# EAGLE design eNode_Spark (EAGLE 6.4)

## Sheet 1 of 3: Power & MCU
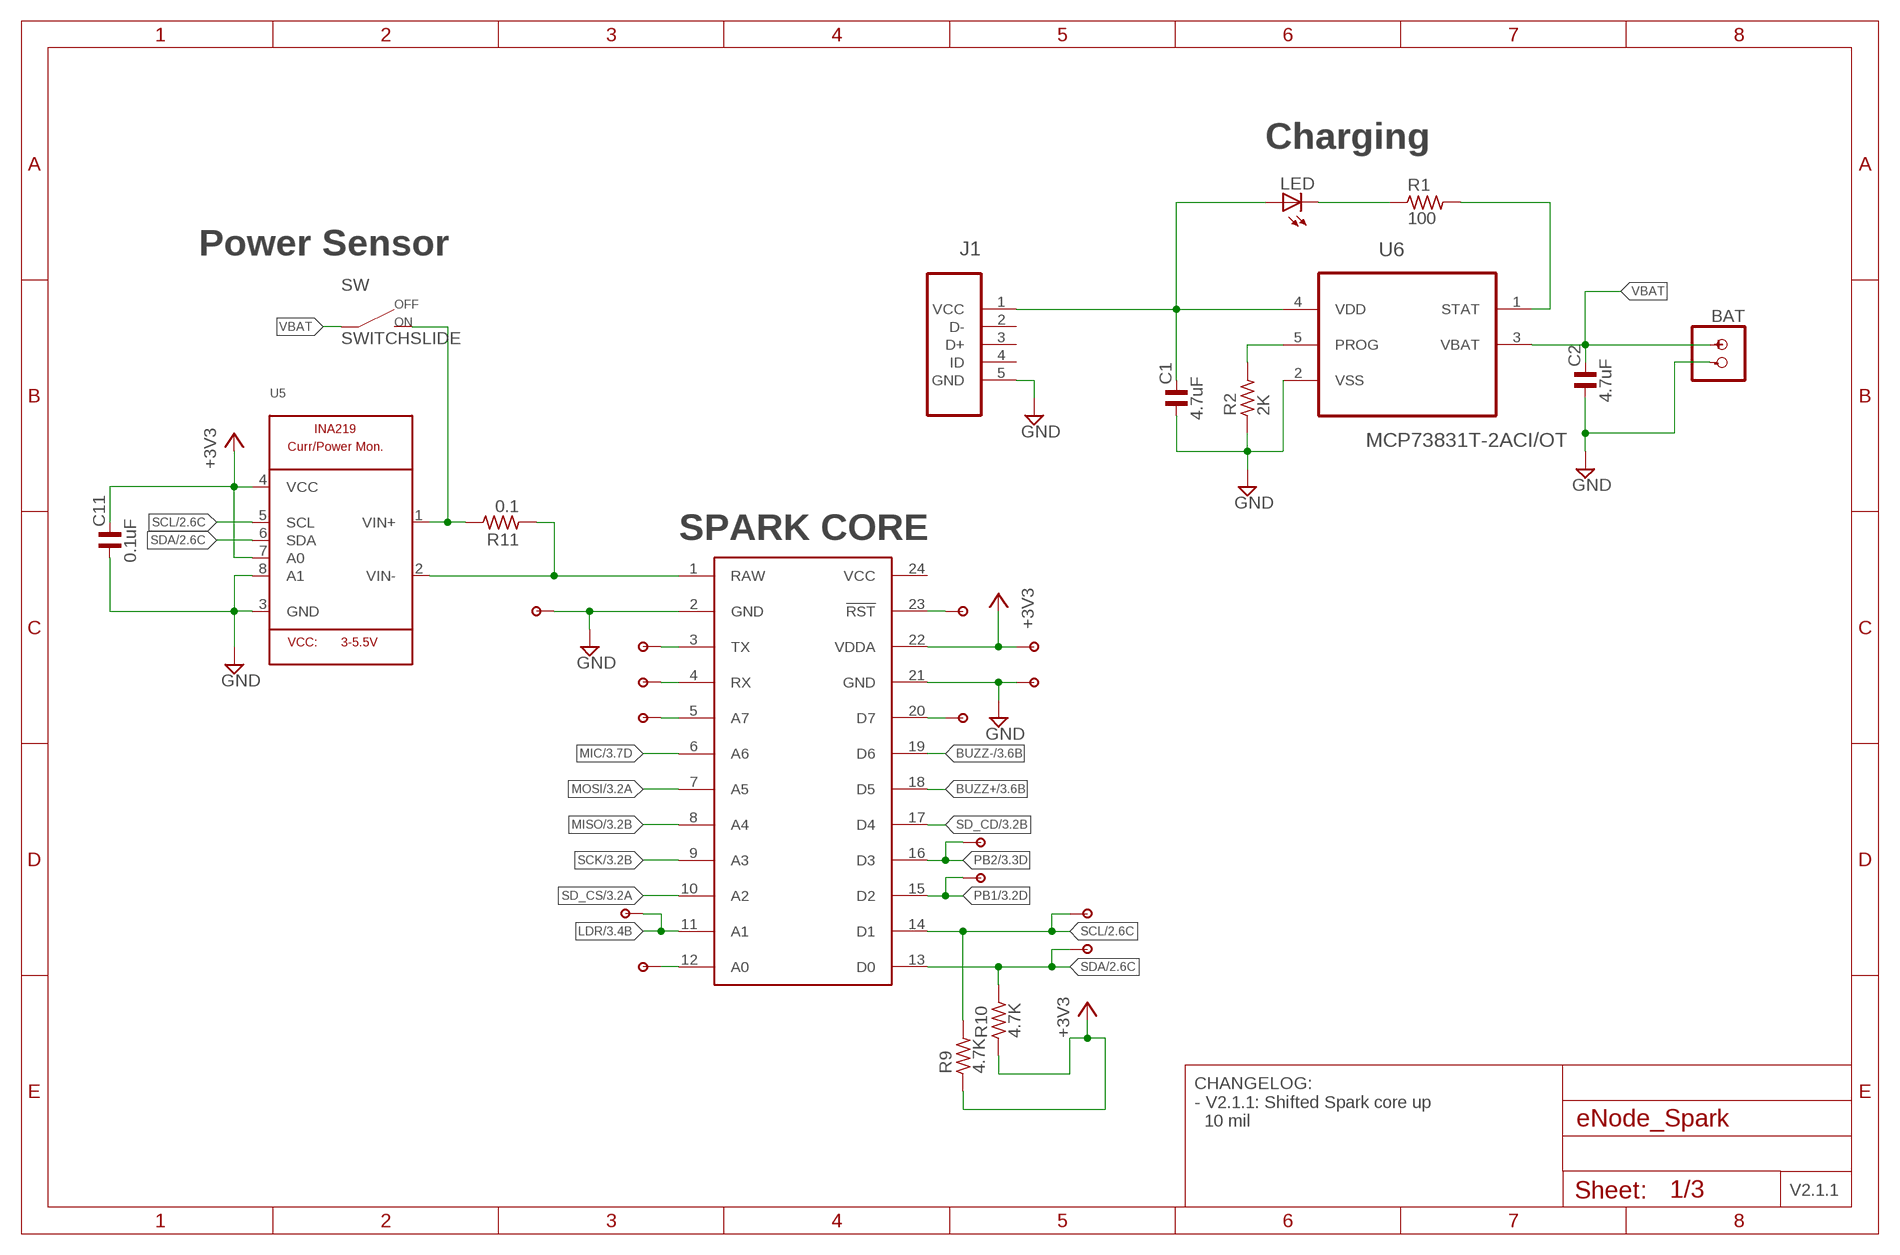
[diagram p0: schematic, sheet 1]

### Parts
BAT  BATTERYSMT  [JST-2-SMD]
C1  4.7uF  C_0402  [C0402]
C2  4.7uF  C_0402  [C0402]
C11  0.1uF  C_0402  [C0402]
J1  47346-0001  [MOLEX_47346-0001]
LED  LED  [RA_SMD_LED]
R1  100  R_0603  [R0603]
R2  2K  R_0603  [R0603]
R9  4.7K  R_0603  [R0603]
R10  4.7K  R_0603  [R0603]
R11  0.1  R_2512  [R2512]
SPARK  SPARK_CORECORE  [SPARK_CORE]
SW  SWITCHSLIDE  [CHANGE_OVER_SLIDE]
U5  INA219  [SOT23-8]
U6  MCP73831T-2ACI/OT  [SOT95P280X145-5N]
U$1  1PIN  [1PIN]
U$2  1PIN  [1PIN]
U$6  1PIN  [1PIN]
U$7  1PIN  [1PIN]
U$8  1PIN  [1PIN]
U$9  1PIN  [1PIN]
U$10  1PIN  [1PIN]
U$11  1PIN  [1PIN]
U$12  1PIN  [1PIN]
U$13  1PIN  [1PIN]
U$14  1PIN  [1PIN]
U$15  1PIN  [1PIN]
U$16  1PIN  [1PIN]
U$17  1PIN  [1PIN]

### Nets
+3V3: C11.2 R9.1 R10.1 SPARK.22(VDDA) U5.4(VCC) U5.7(A0) U$6.P$1 ; also sheet 2,3
BUZZ+: SPARK.18(D5) ; also sheet 3
BUZZ-: SPARK.19(D6) ; also sheet 3
GND: BAT.- C1.1 C2.1 C11.1 J1.5(GND) R2.1 SPARK.2(GND) SPARK.21(GND) U5.3(GND) U5.8(A1) U6.2(VSS) U$11.P$1 U$17.P$1 ; also sheet 2,3
LDR: SPARK.11(A1) U$16.P$1 ; also sheet 3
MIC: SPARK.6(A6) ; also sheet 3
MISO: SPARK.8(A4) ; also sheet 3
MOSI: SPARK.7(A5) ; also sheet 3
N$1: C1.2 J1.1(VCC) LED.A U6.4(VDD)
N$3: R11.1 SPARK.1(RAW) U5.2(VIN-)
N$4: R2.2 U6.5(PROG)
N$5: LED.C R1.1
N$6: R1.2 U6.1(STAT)
N$10: SPARK.5(A7) U$2.P$1
N$11: R11.2 SW.2 U5.1(VIN+)
N$15: SPARK.20(D7) U$10.P$1
N$16: SPARK.12(A0) U$1.P$1
N$19: SPARK.3(TX) U$12.P$1
N$20: SPARK.4(RX) U$13.P$1
N$21: SPARK.23(!RST) U$14.P$1
PB1: SPARK.15(D2) U$9.P$1 ; also sheet 3
PB2: SPARK.16(D3) U$15.P$1 ; also sheet 3
SCK: SPARK.9(A3) ; also sheet 3
SCL: R9.2 SPARK.14(D1) U5.5(SCL) U$7.P$1 ; also sheet 2
SD_CD: SPARK.17(D4) ; also sheet 3
SD_CS: SPARK.10(A2) ; also sheet 3
SDA: R10.2 SPARK.13(D0) U5.6(SDA) U$8.P$1 ; also sheet 2
VBAT: BAT.+ C2.2 SW.1 U6.3(VBAT)
Unconnected: J1.2(D-) J1.3(D+) J1.4(ID)

### Notes on the sheet
- Charging
- Power Sensor
- SPARK CORE
- CHANGELOG:
  - V2.1.1: Shifted Spark core up 
    10 mil
- V2.1.1

## Sheet 2 of 3: I2C
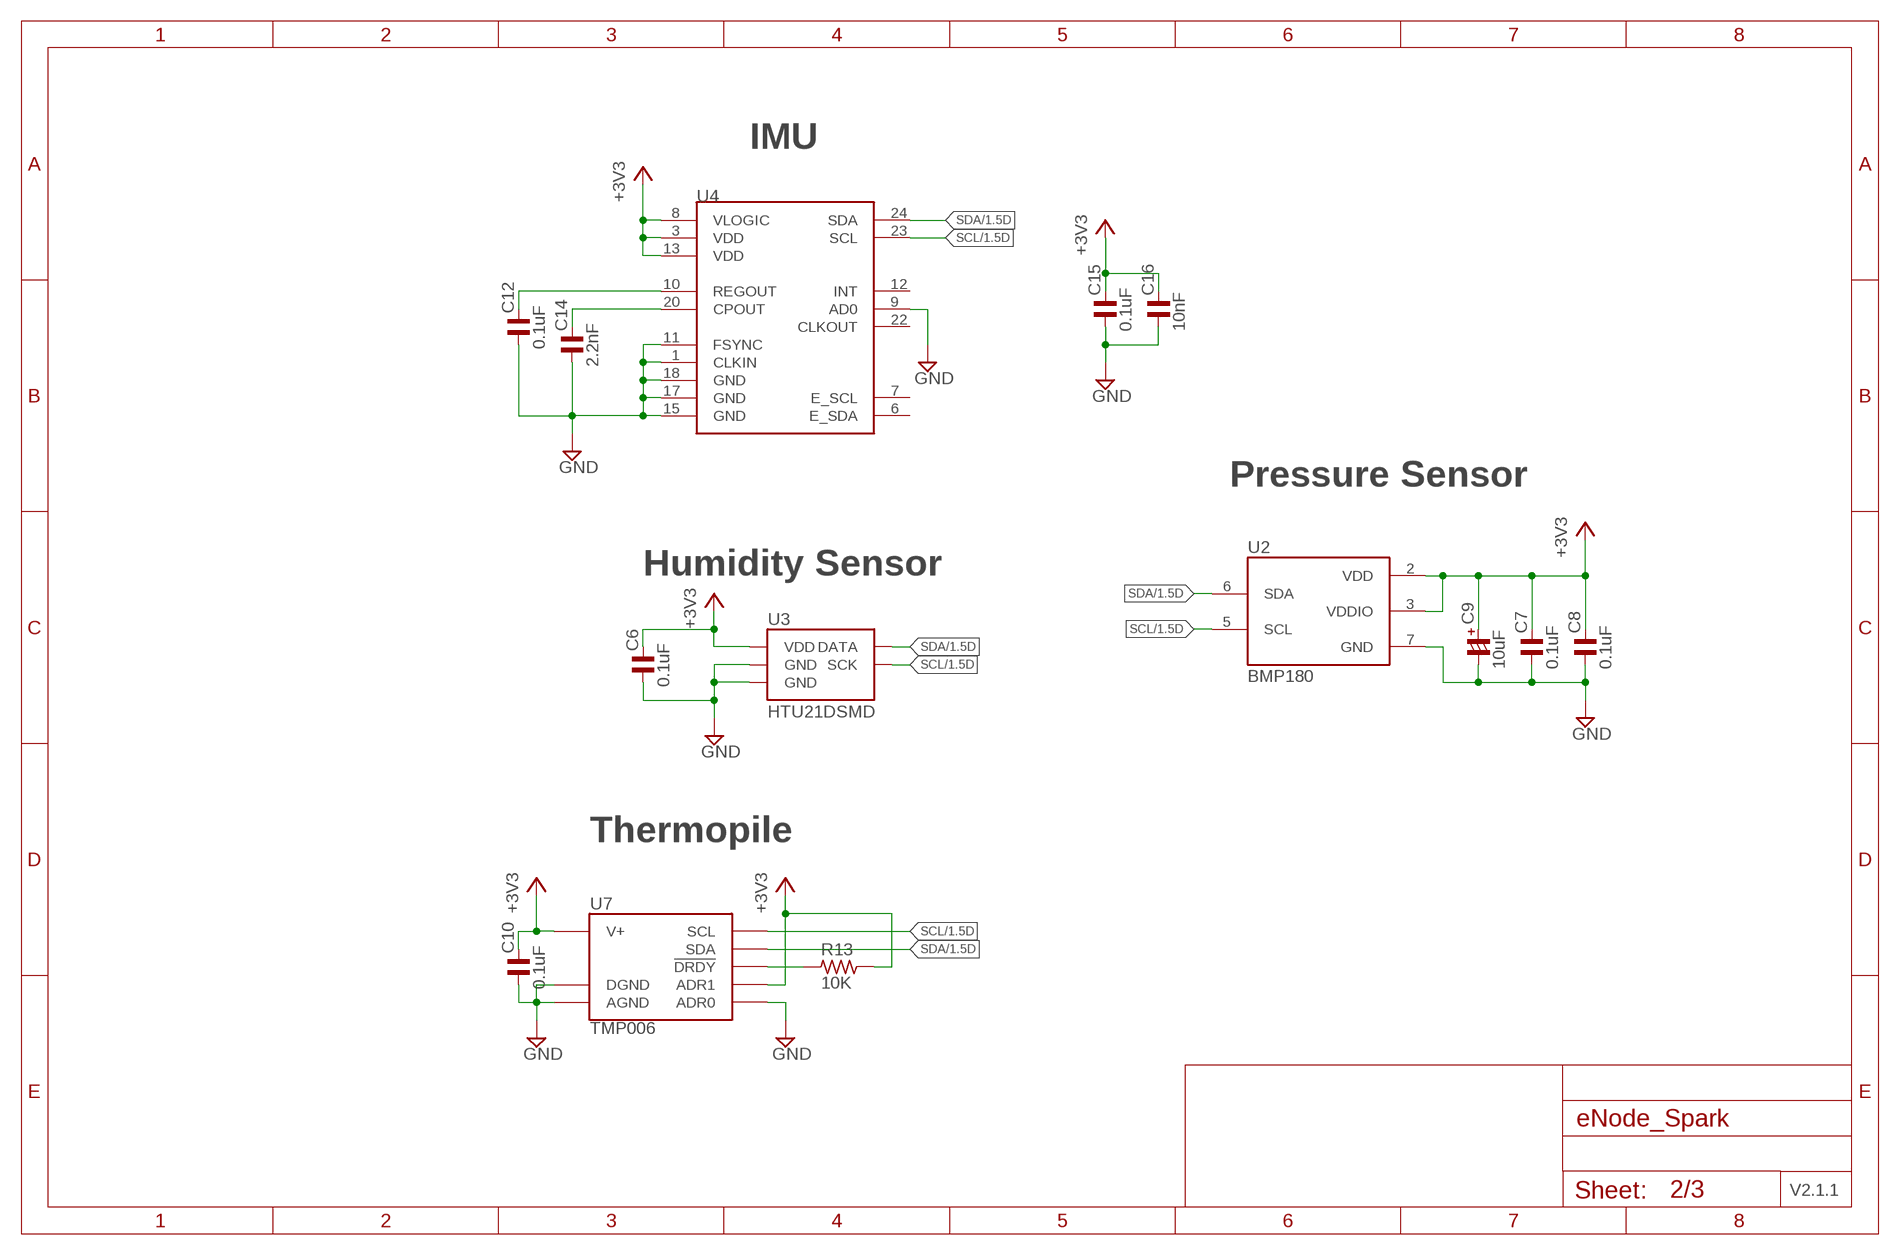
[diagram p1: schematic, sheet 2]

### Parts
C6  0.1uF  C_0402  [C0402]
C7  0.1uF  C_0402  [C0402]
C8  0.1uF  C_0402  [C0402]
C9  10uF  CP_1206/T  [C1206/T]
C10  0.1uF  C_0402  [C0402]
C12  0.1uF  C_0402  [C0402]
C14  2.2nF  C_0402  [C0402]
C15  0.1uF  C_0402  [C0402]
C16  10nF  C_0402  [C0402]
R13  10K  R_0603  [R0603]
U2  BMP180  [BMP180]
U3  HTU21DSMD  [HTU21D]
U4  MPU-9150QFN-24-NP  [QFN-24-NP]
U7  TMP006  [BGA8DS]

### Nets
+3V3: C6.2 C7.2 C8.2 C9.+ C10.2 C15.2 C16.2 R13.2 U2.2(VDD) U2.3(VDDIO) U3.VDD U4.3(VDD) U4.8(VLOGIC) U4.13(VDD) U7.A3(V+) U7.B1(ADR1) ; also sheet 1,3
GND: C6.1 C7.1 C8.1 C9.- C10.1 C12.1 C14.1 C15.1 C16.1 U2.7(GND) U3.7(GND) U3.GND U4.1(CLKIN) U4.9(AD0) U4.11(FSYNC) U4.15(GND) U4.17(GND) U4.18(GND) U7.A1(DGND) U7.A2(AGND) U7.C1(ADR0) ; also sheet 1,3
N$12: C14.2 U4.20(CPOUT)
N$13: R13.1 U7.C2(!DRDY)
N$14: C12.2 U4.10(REGOUT)
SCL: U2.5(SCL) U3.SCK U4.23(SCL) U7.B3(SCL) ; also sheet 1
SDA: U2.6(SDA) U3.DATA U4.24(SDA) U7.C3(SDA) ; also sheet 1
Unconnected: U4.6(E_SDA) U4.7(E_SCL) U4.12(INT) U4.22(CLKOUT)

### Notes on the sheet
- IMU
- Pressure Sensor
- Humidity Sensor
- Thermopile
- V2.1.1

## Sheet 3 of 3: Other IO
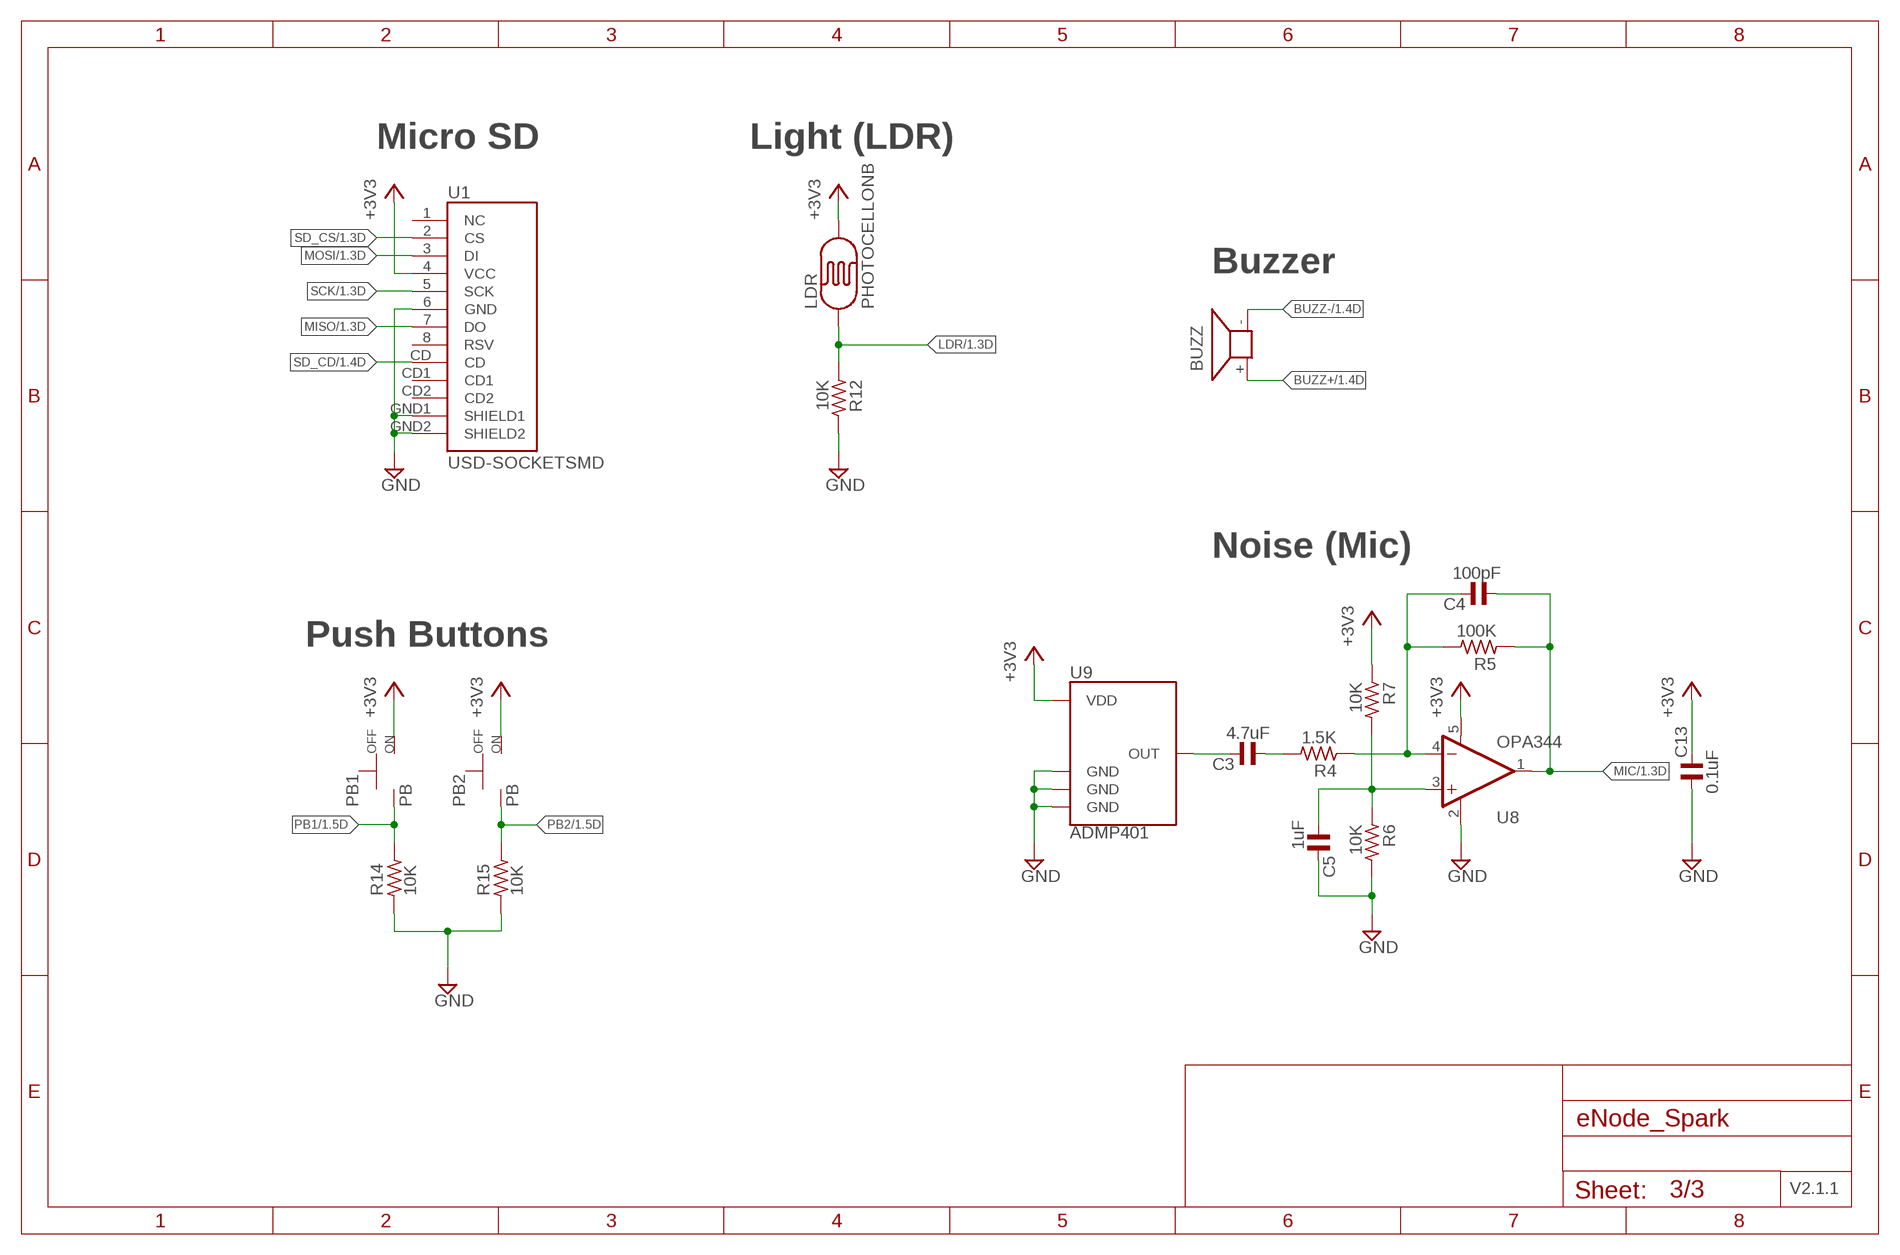
[diagram p2: schematic, sheet 3]

### Parts
BUZZ  BUZZER  [OFFBOARD_NOSIGN]
C3  4.7uF  C_0402  [C0402]
C4  100pF  C_0402  [C0402]
C5  1uF  C_0402  [C0402]
C13  0.1uF  C_0402  [C0402]
LDR  PHOTOCELLONB  [ON_BOARD]
PB1  PB  [PB]
PB2  PB  [PB]
R4  1.5K  R_0402  [R0402]
R5  100K  R_0402  [R0402]
R6  10K  R_0402  [R0402]
R7  10K  R_0402  [R0402]
R12  10K  R_0603  [R0603]
R14  10K  R_0603  [R0603]
R15  10K  R_0603  [R0603]
U1  USD-SOCKETSMD  [MICRO-SD-SOCKET-PP]
U8  OPA344  [SOT23-5]
U9  ADMP401  [ADMP401]

### Nets
+3V3: C13.2 LDR.2 PB1.2 PB2.2 R7.1 U1.4(VCC) U8.5(V+) U9.5(VDD) ; also sheet 1,2
BUZZ+: BUZZ.+ ; also sheet 1
BUZZ-: BUZZ.- ; also sheet 1
GND: C5.2 C13.1 R6.2 R12.2 R14.1 R15.1 U1.6(GND) U1.GND1(SHIELD1) U1.GND2(SHIELD2) U8.2(V-) U9.2(GND) U9.4(GND) U9.6(GND) ; also sheet 1,2
LDR: LDR.1 R12.1 ; also sheet 1
MIC: C4.1 R5.1 U8.1(OUT) ; also sheet 1
MISO: U1.7(DO) ; also sheet 1
MOSI: U1.3(DI) ; also sheet 1
N$2: C3.2 U9.1(OUT)
N$7: C3.1 R4.2
N$8: C4.2 R4.1 R5.2 U8.4(-IN)
N$9: C5.1 R6.1 R7.2 U8.3(+IN)
PB1: PB1.1 R14.2 ; also sheet 1
PB2: PB2.1 R15.2 ; also sheet 1
SCK: U1.5(SCK) ; also sheet 1
SD_CD: U1.CD ; also sheet 1
SD_CS: U1.2(CS) ; also sheet 1
Unconnected: U1.1(NC) U1.8(RSV) U1.CD1 U1.CD2

### Notes on the sheet
- Micro SD | Light (LDR)
- Buzzer
- Noise (Mic)
- Push Buttons
- V2.1.1

## Power pins joined to a net without a drawn wire
VCC: SPARK.24(VCC)

## Library data of the parts
BAT = Battery:BATTERY: PIN HEADER
BUZZ = Buzzer:BUZZER: Buzzer
C1-C8 C10-C16 = rc-master-smd:C_: NON-POLARIZED CAP
C9 = rc-master-smd:CP_: POLARIZED CAP
J1 = Micro USB B:47346-0001: CONN RCPT 5POS MICRO USB R/A SMD; MPN: 47346-0001; OC_FARNELL: 1568026; OC_NEWARK: 47M0505; PACKAGE: 5 POS MICRO USB R/A; SUPPLIER: MOLEX
LDR = LDR:PHOTOCELL: Photo Resitor
LED = LED:LED: LEDs
PB1 PB2 = Push Button:PB
R1 R2 R4-R7 R9-R15 = rc-master-smd:R_: RESISTOR
SPARK = Spark Core:SPARK_CORE
SW = Switch:SWITCH
U1 = MicroSD:USD-SOCKET: microSD Socket Push-push type uSD socket. Schematic element and footprint production proven. Spark Fun Electronics SKU : PRT-00127. tDoc lines correctly indicate media card edge positions when inserting (unlocked, locked, depressed).; ORDERCODE: 2143377; SUPPLIER: ELEMENT14
U2 = BMP180:BMP180: BOSCH BMP180 DIGITAL BAROMETRIC PRESSURE SENSOR Web page: http://www.bosch-sensortec.com/en/homepage/products_3/environmental_sensors_1/bmp180_1/bmp180 Datasheet: http://ae-bst.resource.bosch.com/media/products/dokumente/bmp180/BST-BMP180-DS000-09.pdf The BMP180 is the function compatible successor of the BMP085, a new generation of high precision digital pressure sensors for consumer applications. The ultra-low power, low voltage electronics of the BMP180 is optimized for use in mobile phones, PDAs, GPS navigation devices and outdoor equipment. With a low altitude noise of merely 0.25m at fast conversion time, the BMP180 offers superior performance. The I2C interface allows for easy system integration with a microcontroller. The BMP180 is based on piezo-resistive technology for EMC robustness, high accuracy and linearity as well as long term stability. Key features: - Temperature measurement included - I2C interface - Fully calibrated - Pb-free, halogen-free and RoHS compliant, - MSL 1 Basic specs: Pressure range: 300 to 1100hPa (+9000m to -500m relating to sea level) Supply voltage: 1.8 to 3.6V (VDD), 1.62V to 3.6V (VDDIO) Package: LGA package with metal lid Small footprint: 3.6mm x 3.8mm Super-flat: 0.93mm height Low power: 5µA at 1 sample / sec. in standard mode Low noise: 0.06hPa (0.5m) in ultra low power mode, 0.02hPa (0.17m) advanced resolution mode Typical applications: - Enhancement of GPS navigation (dead-reckoning, slope detection, etc.) - In- and out-door navigation - Leisure and sports - Weather forecast - Vertical velocity indication (rise/sink speed)
U3 = HTU21D:HTU21D
U4 = MPU-9150:MPU-9150: 9DOF (3mag, 3accel, 3rotat). I2C interface.
U5 = INA219:INA219: INA219 - I2C Current/Power Monitor Voltage Range: 0-26V Accuracy: 0.5% Temperature: -40°C - 125°C
U6 = MCP73831T (LiPo Charger):MCP73831T-2ACI/OT: Charge Management Controller; MPN: MCP73831T-2ACI/OT; OC_FARNELL: 1332158; OC_NEWARK: 56K7045; PACKAGE: SOT-5; SUPPLIER: Microchip
U7 = TMP006:TMP006
U8 = OPA344:OPA344
U9 = ADMP401:ADMP401
U$1 U$2 U$6-U$17 = Single Pin Breakout:1PIN

## Board
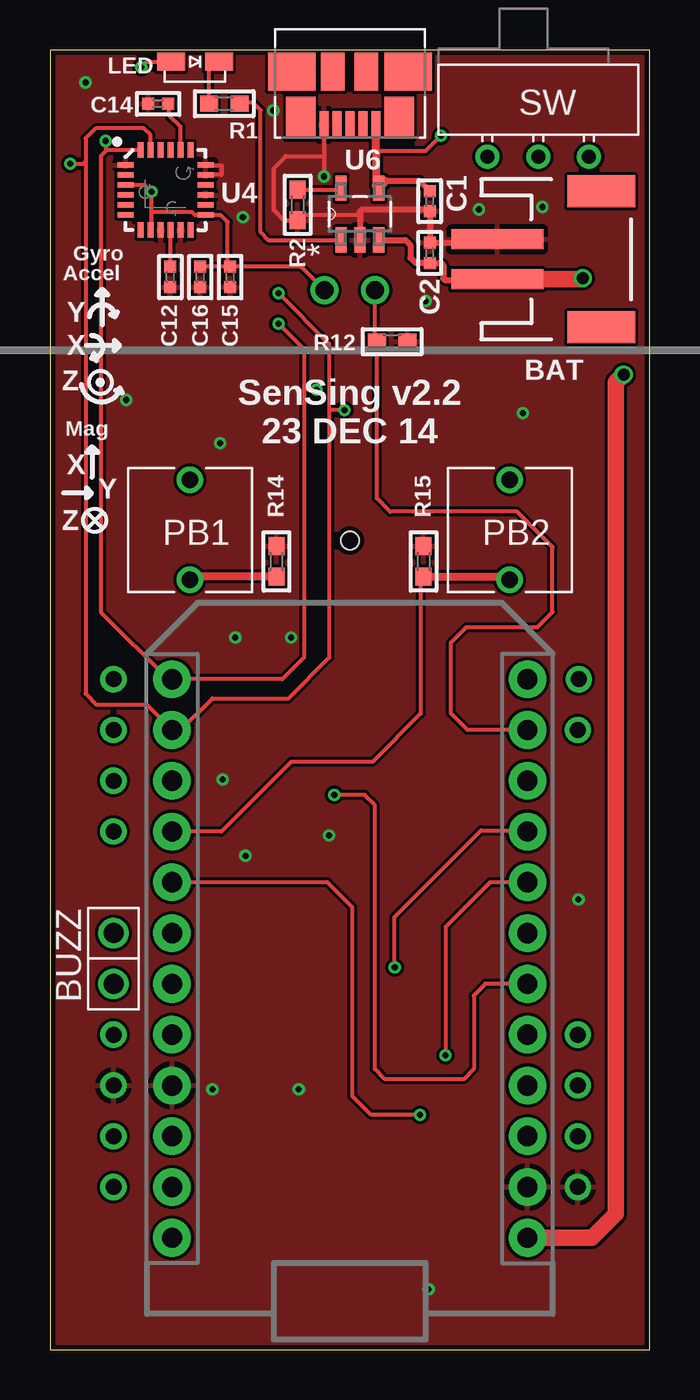
[diagram p3: board, top side]
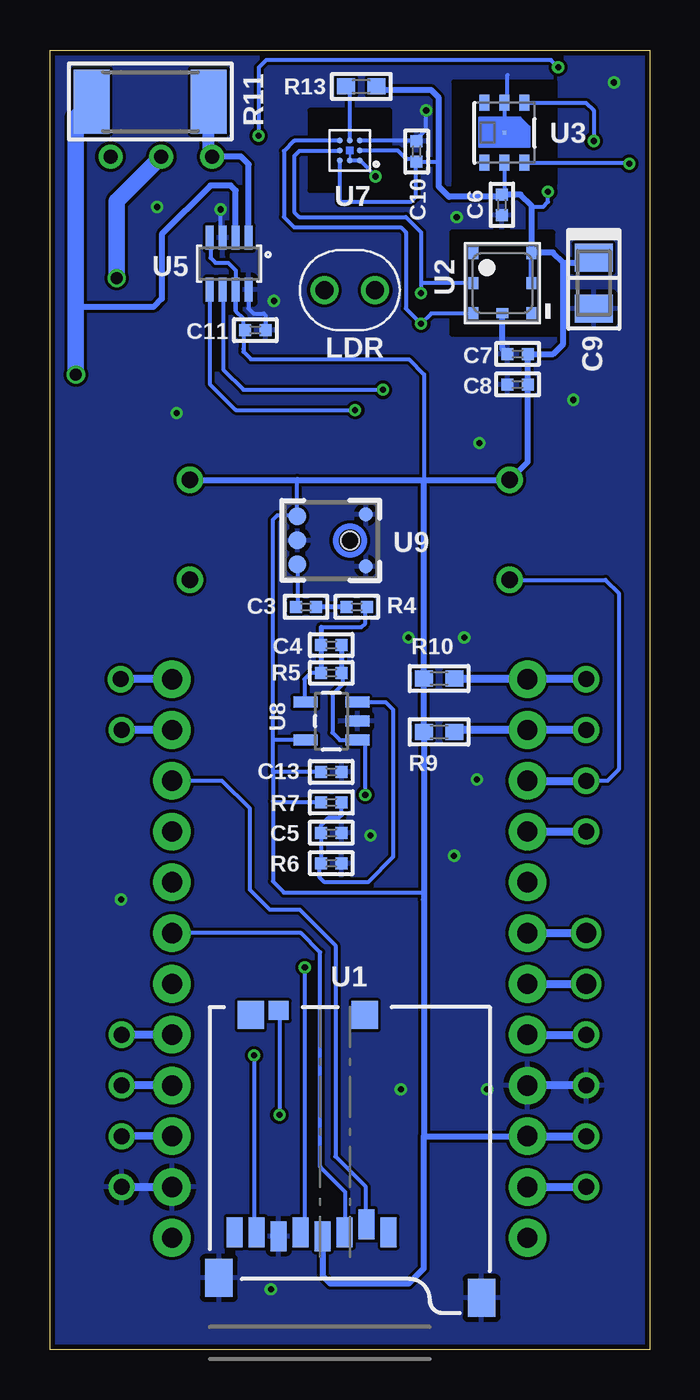
[diagram p4: board, bottom side, seen from below]

Size 30 x 65 mm. Coordinates in mm from the lower left corner, seen from the top.
Outline: 0,0 30,0 30,65 0,65 0,0
Copper layers (1*16): Top 0.035mm / dielectric 1.5mm / Bottom 0.035mm
Design rules "ITEADstudio_DRC": minimum track width 6mil, minimum drill 12mil, track to track 6mil, track to pad 6mil, pad to pad 6mil, via to via 6mil, smd to smd 0mil, copper to edge 10mil, drill to drill 10mil, minimum pad ring 10mil, minimum via ring 6mil, stop-mask expansion 2mil, vias tented up to drill 100mil, thermal gap 10mil

### Footprints (pad centres in the part's own frame; a part is rotated, then mirrored left to right if it is on the bottom)
JST-2-SMD = smd 1 x 4.6: + 1,-3.7; - -1,-3.7 | smd 1.6 x 3.4: NC1 -3.4,1.5; NC2 3.4,1.5
OFFBOARD_NOSIGN = drill 1: + -1.27,0; - 1.27,0
C0402 = smd 0.6 x 0.6: 1 -0.508,0; 2 0.508,0
C1206/T = smd 1.4 x 1.9: + 1.27,0; - -1.27,0
MOLEX_47346-0001 = smd 0.45 x 1.38: 1 -1.3,0; 2 -0.65,0; 3 0,0; 4 0.65,0; 5 1.3,0 | smd 1.475 x 2.1: M1 -2.462,-0.36; M2 2.462,-0.36 | smd 2.375 x 1.9: M3 -2.913,-2.66; M6 2.913,-2.66 | smd 1.175 x 1.9: M4 -0.82,-2.66; M5 0.85,-2.66
ON_BOARD = drill 0.9: 1 -1.27,0; 2 1.27,0
RA_SMD_LED = smd 1.4 x 0.9: A 1.2,0; C -1.2,0
PB = drill 0.813: 1 -2.5,0; 2 2.5,0
R0603 = smd 0.9 x 0.8: 1 -0.762,0; 2 0.762,0
R0402 = smd 0.6 x 0.6: 1 -0.508,0; 2 0.508,0
R2512 = smd 1.8 x 3.2: 1 -2.921,0; 2 2.921,0
SPARK_CORE = drill 1.016 pad 1.88: 1 -8.89,13.97; 2 -8.89,11.43; 3 -8.89,8.89; 4 -8.89,6.35; 5 -8.89,3.81; 6 -8.89,1.27; 7 -8.89,-1.27; 8 -8.89,-3.81; 9 -8.89,-6.35; 10 -8.89,-8.89; 11 -8.89,-11.43; 12 -8.89,-13.97; 13 8.89,-13.97; 14 8.89,-11.43; 15 8.89,-8.89; 16 8.89,-6.35; 17 8.89,-3.81; 18 8.89,-1.27; 19 8.89,1.27; 20 8.89,3.81; 21 8.89,6.35; 22 8.89,8.89; 23 8.89,11.43; 24 8.89,13.97
CHANGE_OVER_SLIDE = drill 0.7: 1 0,0; 2 -2.54,0; 3 2.54,0
MICRO-SD-SOCKET-PP = smd 0.8 x 1.5: 1 7.54,-11.26; 2 6.44,-10.86; 3 5.34,-11.26; 4 4.24,-11.46; 5 3.14,-11.26; 6 2.04,-11.46; 7 0.94,-11.26; 8 -0.16,-11.26 | smd 1 x 0.95: CD 2.04,-0.175 | smd 1.3 x 1.4: CD1 6.35,-0.4; CD2 0.65,-0.4 | smd 1.4 x 1.9: GND1 12.2,-14.55; GND2 -0.95,-13.55
BMP180 = smd 0.6 x 0.5: 1 1.5,1.45; 2 0,1.45; 3 -1.5,1.45; 4 -1.5,-1.45; 5 0,-1.45; 6 1.5,-1.45 | smd 0.5 x 0.6: 7 1.5,0
HTU21D = smd 0.2 x 0.2: 7 0,0 | smd 0.8 x 0.5: DATA 1.5,-1; GND 1.5,0; NC@1 -1.5,1; NC@6 1.5,1; SCK -1.5,-1; VDD -1.5,0
QFN-24-NP = smd 0.8 x 0.3: 1 -2,1.25; 2 -2,0.75; 3 -2,0.25; 4 -2,-0.25; 5 -2,-0.75; 6 -2,-1.25; 13 2,-1.25; 14 2,-0.75; 15 2,-0.25; 16 2,0.25; 17 2,0.75; 18 2,1.25 | smd 0.3 x 0.8: 7 -1.25,-2; 8 -0.75,-2; 9 -0.25,-2; 10 0.25,-2; 11 0.75,-2; 12 1.25,-2; 19 1.25,2; 20 0.75,2; 21 0.25,2; 22 -0.25,2; 23 -0.75,2; 24 -1.25,2
SOT23-8 = smd 0.4 x 1.2: 1 -0.975,-1.3; 2 -0.325,-1.3; 3 0.325,-1.3; 4 0.975,-1.3; 5 0.975,1.3; 6 0.325,1.3; 7 -0.325,1.3; 8 -0.975,1.3
SOT95P280X145-5N = smd 1.27 x 0.559: 1 -1.295,0.94; 2 -1.295,0; 3 -1.295,-0.94; 4 1.295,-0.94; 5 1.295,0.94
BGA8DS = smd 0.305 x 0.305: A1 0.5,-0.5; A2 0,-0.5; A3 -0.5,-0.5; B1 0.5,0; B3 -0.5,0; C1 0.5,0.5; C2 0,0.5; C3 -0.5,0.5
SOT23-5 = smd 0.55 x 1.2: 1 -0.95,-1.3; 2 0,-1.3; 3 0.95,-1.3; 4 0.95,1.3; 5 -0.95,1.3
ADMP401 = smd 0.9 x 0.9: 1 -1.2,2.62; 5 1.2,2.62; 6 0,2.62 | smd 0.7 x 0.7: 2 1.3,-0.8; 4 -1.3,-0.8 | hole 0.9: 0,0
1PIN = drill 0.8: P$1 0,0

### Placement (x,y rotation side)
BAT  26.08,54.53 270 top
BUZZ  3.17,19.56 270 top
C1  19,57.44 90 top
C2  19,54.84 270 top
C3  17.19,37.15 180 bottom
C4  15.92,35.24 180 bottom
C5  15.92,25.85 0 bottom
C6  7.39,57.26 90 bottom
C7  6.6,49.8 0 bottom
C8  6.6,48.27 0 bottom
C9  2.79,53.34 90 bottom
C10  11.65,59.92 270 bottom
C11  19.72,50.99 180 bottom
C12  6.02,53.64 90 top
C13  15.93,28.89 180 bottom
C14  5.41,62.31 0 top
C15  9.02,53.64 90 top
C16  7.52,53.64 90 top
J1  15,61.25 180 top
LDR  15,52.98 0 bottom
LED  7.25,64.41 180 top
PB1  7,41 90 top
PB2  23,41 90 top
R1  8.72,62.31 0 top
R2  12.39,57.26 90 top
R4  14.65,37.15 180 bottom
R5  15.92,33.84 180 bottom
R6  15.92,24.32 0 bottom
R7  15.92,27.37 0 bottom
R9  10.53,30.89 0 bottom
R10  10.53,33.56 0 bottom
R11  24.98,62.42 0 bottom
R12  17.11,50.41 0 top
R13  14.42,63.18 0 bottom
R14  11.33,39.42 270 top
R15  18.7,39.42 270 top
SPARK  15,19.56 180 top
SW  24.43,59.67 0 top
U1  20.6,17.13 0 bottom
U2  7.37,53.34 270 bottom
U3  7.26,60.86 90 bottom
U4  5.78,58 0 top
U5  21.03,54.31 180 bottom
U6  15.51,56.79 90 top
U7  15,59.98 0 bottom
U8  15.92,31.43 90 bottom
U9  15,40.47 90 bottom
U$1  26.46,33.53 0 top
U$2  26.42,15.75 0 top
U$6  3.17,10.67 0 top
U$7  3.17,30.99 0 top
U$8  3.17,33.53 0 top
U$9  3.17,28.45 0 top
U$10  3.17,15.75 0 top
U$11  26.42,8.13 0 top
U$12  26.42,10.67 0 top
U$13  26.42,13.21 0 top
U$14  3.17,8.13 0 top
U$15  3.17,25.91 0 top
U$16  26.42,30.99 0 top
U$17  3.17,13.21 0 top

### Tracks (layer width: path | path; a pad name or v marks a point on that pad's centre or on a via)
+3V3  (via drill 0.3)
  Top 0.203: 8.89,54.28 C15.2 12.56,54.15 LDR.2 | 8.89,54.28 8.76,54.15 C16.2 | U4.8 5.08,56.05 5.08,56.9 | U4.3 4.74,58.25 v5.08,57.91 5.08,56.9 | 5.08,56.9 7.11,56.9 7.26,56.75 U4.13 8.53,56.75 8.89,56.39 8.89,54.28
  Bottom 0.203: 16.43,27.5 R7.1 18.78,27.37 18.84,27.43 | 18.84,28.89 18.84,30.48 | U8.5 18.84,30.48 | 18.84,30.48 18.84,41.5 18.63,41.72 17.67,41.72 U9.5 | C13.2 18.84,28.89 | R10.1 11.29,33.31 | U7.B1 12.61,59.98 12.19,59.56 11.8,59.56 C10.2 | U5.4 21.97,55.58 21.97,54.61 21.72,54.36 21.08,54.36 20.71,53.98 U5.7 | 20.32,50.04 20.32,50.9 C11.2 20.32,51.08 | 20.32,51.08 20.32,51.56 20.7,51.94 | 20.7,51.94 20.71,51.95 U5.7 | U7.A3 15.5,57.41 15.49,57.4 11.94,57.4 11.68,57.66 11.68,59.38 C10.2 | C10.2 10.57,59.41 10.54,59.44 | 5.89,57.15 5.33,57.15 5.08,57.4 v5.08,57.91 | U3.VDD 7.26,57.76 | U5.7 20.71,52.71 arc-90 20.7,52.7 20.7,51.94 | 20.32,51.08 20.32,49.91 19.94,49.53 12.05,49.53 11.29,48.77 11.29,43.43 | U9.5 | U9.5 17.63,43.5 | 18.84,28.89 18.84,27.43 | 18.84,27.43 18.84,23.42 18.29,22.86 11.29,22.86 11.29,22.5
  Bottom 0.254: U2.2 U2.3
  Bottom 0.305: U1.4 16.36,3.68 15.98,3.3 12.05,3.3 11.29,4.06 11.29,10.67 | 20.74,53.01 U5.7 | PB2.2 17.63,43.5 PB1.2 6.09,44.41 C8.2 C7.2 4.81,49.8 4.32,50.29 4.32,54.36 | 11.29,10.67 11.29,22.5 R9.1 R10.1 | 11.29,10.67 SPARK.22 | 11.29,33.31 11.29,43.43 | 4.32,54.36 4.83,54.86 5.89,54.86 | 5.89,54.86 U2.3 | 4.32,54.36 3.05,54.36 C9.+ | 5.89,54.86 5.89,57.15 5.89,57.2 6.46,57.76 7.26,57.76 C6.2 7.5,57.66 10.03,57.66 10.54,58.17 10.54,59.44 10.54,62.61 10.92,62.99 13.47,62.99 R13.2
  Bottom 0.406: SPARK.22 U$6.P$1
BUZZ+
  Bottom 0.406: SPARK.18 BUZZ.+
BUZZ-
  Bottom 0.406: SPARK.19 BUZZ.-
GND  (via drill 0.3)
  Top 0.203: J1.5 13.7,59.69 | 13.7,59.69 13.7,58.69 v13.72,58.67 | C16.1 7.42,52.89 | 15.51,56.77 12.67,56.77 R2.1 11.68,56.5 11.18,57.01 11.18,59.05 11.81,59.69 13.7,59.69 | C15.1 9.09,52.96 | U4.18 7.78,59.23 8.59,59.23 8.59,58.75 7.75,58.75
  Top 0.305: U6.2 15.51,56.77 15.51,56.91 15.62,57.02 18.7,57.02 C1.1 C2.1 22.38,55.35 BAT.-
  Bottom 0.203: U8.2 14.37,31.3 14.22,31.45 | U5.3 21.46,55.61 v21.46,57.02 | U7.C1 11.7,60.48 | 11.7,60.48 C10.1 | U7.A2 U7.A1 13.72,58.69 v13.72,58.67 | U5.8 20.07,52.07 19.81,51.82 19.3,51.82 19.21,51.73 C11.1 | 11.7,60.48 11.18,61 v11.18,61.98 | 7.11,63.75 7.11,62.51 U3.GND U3.7
  Bottom 0.305: C7.1 7.37,50.05 U2.7
  Bottom 0.406: 26.53,8.13 SPARK.2 | U$17.P$1 SPARK.21
  other vias: 3.81,47.5 23.66,46.84 24.64,57.15 18.8,52.45 9.65,56.64 8.13,13.01 12.45,13.01 12.06,35.62 8.51,45.34 13.97,25.71 9.78,24.7 8.64,28.51 26.45,22.51 18.95,3.01 1.78,63.37 9.27,35.62
  pour Bottom: 0,65 30,65 30,0 0,0
  pour Top: 0,65 30,65 30,0 0,0
LDR
  Top 0.203: SPARK.11 20.89,30.99 20.07,31.81 20.07,35.36 20.83,36.13 24.38,36.13 25.15,36.89 25.15,40.13 23.37,41.91 17.02,41.91 16.35,42.58 R12.1 16.27,50.49 LDR.1
  Bottom 0.406: SPARK.11 U$16.P$1
MIC  (via drill 0.3)
  Top 0.203: SPARK.6 21.79,18.29 21.21,17.71 21.21,14.03 20.7,13.52 16.76,13.52 16.26,14.03 16.26,27.24 15.75,27.74 v14.22,27.74
  Bottom 0.203: R5.1 15.37,33.8 15.37,33.27 15.88,32.77 15.88,30.86 15.49,30.48 U8.1 14.22,30.48 v14.22,27.74
  Bottom 0.254: C4.1 R5.1
MISO  (via drill 0.3)
  Top 0.203: SPARK.8 22.02,23.37 19.79,21.14 v19.79,14.71
  Bottom 0.203: v19.79,14.71 19.79,5.74 arc-90 U1.7
MOSI
  Bottom 0.203: U1.3 15.22,5.66 15.22,7.87 16.49,9.14 16.49,19.87 17.44,20.83 SPARK.7
N$1  (via drill 0.3)
  Top 0.203: 16.3,59.94 18.8,59.94 v19.56,60.71 | v4.57,64.14 4.84,64.41 LED.A
  Top 0.254: U6.4 16.45,57.6
  Top 0.305: 16.81,58.45 18.5,58.45 C1.2
  Top 0.406: J1.1 16.3,59.94 16.3,58.24 U6.4 16.81,58.45
  Bottom 0.203: v19.56,60.71 19.56,64.12 19.18,64.5 4.94,64.5 v4.57,64.14
N$2
  Bottom 0.203: U9.1 17.62,37.22 C3.2
N$3  (via drill 0.6)
  Top 0.813: SPARK.1 27.12,5.59 28.31,6.78 28.31,48.38 v28.7,48.77
  Bottom 0.305: U5.2 20.71,57.96 20.96,58.22 21.97,58.22 24.41,55.78 24.41,52.55 24.82,52.15 28.7,52.15
  Bottom 0.813: v28.7,48.77 28.7,52.15 28.7,61.62 R11.1
N$4
  Top 0.203: R2.2 14.57,58.02 U6.5
  Top 0.305: U6.5 14.57,57.99
  Top 0.406: U6.5 14.57,58.33
N$5
  Top 0.203: R1.1 7.95,64.41 LED.C
N$6
  Top 0.203: 14.57,55.12 U6.1 10.92,55.5 10.54,55.88 10.54,61.98 10.16,62.36 9.52,62.36 R1.2
N$7
  Bottom 0.254: R4.2 C3.1
N$8
  Bottom 0.203: R5.2 16.96,33.84 17.27,33.53 17.27,32.43 U8.4 | 16.43,36.13 14.42,36.13 14.22,36.32 14.22,37.07 R4.1
  Bottom 0.254: 16.43,36.13 C4.2 R5.2
N$9
  Bottom 0.203: 15.54,27.37 R7.2 15.41,26.74 15.54,26.61 16.05,26.61 16.43,26.22 C5.1 R6.1 16.51,24.25 16.51,23.62 16.26,23.37 14.1,23.37 12.83,24.64 12.83,32 13.2,32.38 U8.3
  Bottom 0.406: U8.3 14.27,32.35 14.27,32.32
N$10
  Bottom 0.406: SPARK.5 | SPARK.5 U$2.P$1
N$11
  Bottom 0.305: U5.1 20.06,59.28 20.44,59.67 SW.2
  Bottom 0.61: SW.2 22.06,59.84 R11.2
N$12
  Top 0.203: U4.20 6.53,61.16 5.97,61.72 5.97,62.26 C14.2
N$13
  Bottom 0.203: U7.C2 15,62.99 R13.1
N$14
  Top 0.203: C12.2 U4.10
  Top 0.305: C12.2
N$15
  Bottom 0.406: SPARK.20 U$10.P$1
N$16
  Bottom 0.406: SPARK.12 U$1.P$1
N$17
  cutout Top: 4.19,59.56 7.37,59.56 7.37,56.39 4.19,56.39
N$19
  Bottom 0.406: SPARK.3 U$12.P$1
N$20
  Bottom 0.406: SPARK.4 U$13.P$1
N$21
  Bottom 0.406: SPARK.23 U$14.P$1
N$22
  cutout Bottom (isolate 0.305): 13,61.98 17,61.98 17,57.98 13,57.98
N$23
  cutout Bottom (isolate 0.305): 4.72,58.32 4.72,63.4 9.8,63.4 9.8,58.32
N$24
  cutout Bottom (isolate 0.305): 4.83,55.88 9.91,55.88 9.91,50.8 4.83,50.8
PB1
  Top 0.406: 7.03,38.53 PB1.1 7.16,38.66 R14.2
  Bottom 0.203: PB1.1 2.21,38.5 1.54,37.83 1.54,29.02 2.11,28.45 U$9.P$1
  Bottom 0.406: SPARK.15 U$9.P$1
PB2
  Top 0.203: R15.2 18.54,38.5 18.54,31.81 16.13,29.39 12.06,29.39 8.58,25.91 SPARK.16
  Top 0.406: 22.97,38.53 PB2.1 22.84,38.66 R15.2
  Bottom 0.406: SPARK.16 U$15.P$1
SCK  (via drill 0.3)
  Top 0.203: v17.25,19.11 17.25,21.65 21.57,25.97 23.89,25.97 SPARK.9
  Bottom 0.203: U1.5 17.58,5.62 17.58,6.07 17.25,6.07 v17.25,19.11
SCL  (via drill 0.3)
  Top 0.203: v11.43,52.83 13.97,50.29 13.97,46.99 | v14.73,46.99 13.97,46.99 | U4.23 5.03,60.76 4.7,61.09 2.29,61.09 1.78,60.58 1.78,59.44 | 1.78,59.44 1.78,32.8 2.32,32.26 4.83,32.26 6.1,30.99 SPARK.14 6.55,30.99 8.13,32.57 11.94,32.57 13.97,34.6 13.97,46.99 | v1.02,59.31 1.65,59.31 1.78,59.44
  Bottom 0.203: U2.5 11.43,53.34 | U5.5 22.01,48.3 20.7,46.99 v14.73,46.99 | U7.B3 15.53,59.94 17.53,59.94 17.78,59.69 17.78,56.9 17.53,56.64 12.19,56.64 11.43,55.88 11.43,53.34 | 11.43,53.34 v11.43,52.83 | U3.SCK 1.06,59.36 v1.02,59.31
  Bottom 0.406: R9.2 9.77,30.99 SPARK.14 U$7.P$1
SD_CD  (via drill 0.3)
  Top 0.203: SPARK.17 13.88,23.37 15.11,22.13 15.11,12.7 16.07,11.74 v18.52,11.74
  Bottom 0.203: U1.CD 18.52,16.66 v18.52,11.74
SD_CS
  Bottom 0.203: U1.2 14.2,6.05 14.2,8.13 15.72,9.65 15.72,20.22 17.5,22 19,22 20,23 20,27.06 21.39,28.45 SPARK.10
SDA  (via drill 0.3)
  Top 0.203: v11.43,51.31 12.7,50.04 12.7,48.01 | 12.7,48.01 12.7,34.6 11.63,33.53 SPARK.13 5.9,33.53 2.54,36.89 2.54,59.69 2.79,59.94 | v13.34,48.01 12.7,48.01 | U4.24 2.85,60 2.79,59.94 | v2.79,60.45 2.79,59.94
  Bottom 0.203: 8.81,51.77 8.87,51.82 10.92,51.82 v11.43,51.31 12.19,52.07 12.19,55.88 12.45,56.13 17.78,56.13 18.29,56.64 18.29,59.94 17.78,60.45 15.53,60.45 U7.C3 | U5.6 21.34,52.99 21.34,49.02 20.32,48.01 v13.34,48.01 | U3.DATA 3.18,62.36 2.79,61.98 v2.79,60.45
  Bottom 0.254: 15.5,60.45 U7.C3
  Bottom 0.305: U2.6 8.81,51.77 | 6.11,33.56 SPARK.13
  Bottom 0.406: R10.2 6.11,33.56 3.17,33.56 U$8.P$1
VBAT  (via drill 0.6)
  Top 0.305: U6.3 17.78,55.5 18.03,55.24 18.03,54.61 18.29,54.36 18.98,54.36 C2.2 19.58,54.34 19.68,54.23 19.68,53.56 19.75,53.5 22.38,53.5 BAT.+
  Top 0.813: v26.67,53.59 26.61,53.53 BAT.+
  Bottom 0.813: SW.1 26.67,57.43 v26.67,53.59

### Text on the board
tPlace: Gyro | Accel | Y | X | Z | SenSing v2.2 / 23 DEC 14 | Mag | X | Y | Z